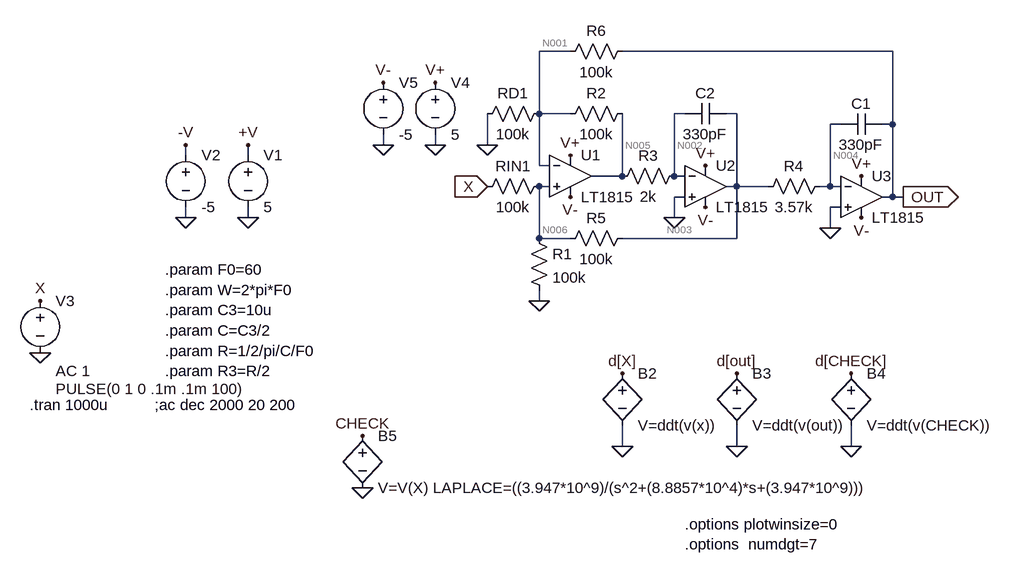
[diagram p0: schematic SR.asc]
* SR.asc
V1 +V 0 5
V2 -V 0 -5
V3 X 0 PULSE(0 1 0 .1m .1m 100) AC 1
B2 d[X] 0 V=ddt(v(x))
B3 d[out] 0 V=ddt(v(out))
B4 d[CHECK] 0 V=ddt(v(CHECK))
B5 CHECK 0 V=V(X) LAPLACE=((3.947*10^9)/(s^2+(8.8857*10^4)*s+(3.947*10^9)))
V4 V+ 0 5
V5 V- 0 -5
RIN1 N006 X 100k
R1 N006 0 100k
R2 N005 N001 100k
R3 N002 N005 2k
C1 OUT N004 330pF
R4 N004 N003 3.57k
C2 N003 N002 330pF
R5 N003 N006 100k
R6 OUT N001 100k
RD1 N001 0 100k
* U1: LT1815 (symbol Opamps\LT1815 not available, pins judged from their places): In+=N006 In-=N001 V+=V+ V-=V- OUT=N005
* U2: LT1815 (symbol Opamps\LT1815 not available, pins judged from their places): In+=0 In-=N002 V+=V+ V-=V- OUT=N003
* U3: LT1815 (symbol Opamps\LT1815 not available, pins judged from their places): In+=0 In-=N004 V+=V+ V-=V- OUT=OUT
.param F0=60
.param W=2*pi*F0
.param C3=10u
.param C=C3/2
.param R=1/2/pi/C/F0
.param R3=R/2
;ac dec 2000 20 200
.tran 1000u
.options plotwinsize=0
.options  numdgt=7
.backanno
.end

* Results of the author's LTspice run, read from the files saved beside the schematic
* Operating Point, zero values left out:
*   V(+v) = 5 V
*   V(-v) = -5 V
*   V(v+) = 5 V
*   V(v-) = -5 V
*   V(n006) = 80.08 mV
*   V(n005) = -4.994 mV
*   V(n001) = 80.08 mV
*   V(n002) = 5.222 µV
*   V(out) = -3.913 mV
*   V(n004) = 3.525 µV
*   V(n003) = -8.92 mV
*   I(Rd1) = 800.8 nA
*   I(R6) = -839.9 nA
*   I(R5) = -890 nA
*   I(R4) = 2.499 µA
*   I(R3) = 2.499 µA
*   I(R2) = -850.7 nA
*   I(R1) = 800.8 nA
*   I(Rin1) = 800.8 nA
*   I(V5) = 19.49 mA
*   I(V4) = -19.5 mA
*   I(V3) = 800.8 nA
*   Ix(u1:1) = -2.491 µA
*   Ix(u1:2) = -2.491 µA
*   Ix(u1:3) = 3.35 µA
*   Ix(u1:4) = 6.499 mA
*   Ix(u1:5) = -6.498 mA
*   Ix(u2:1) = -2.5 µA
*   Ix(u2:2) = -2.499 µA
*   Ix(u2:3) = 3.389 µA
*   Ix(u2:4) = 6.499 mA
*   Ix(u2:5) = -6.498 mA
*   Ix(u3:1) = -2.5 µA
*   Ix(u3:2) = -2.499 µA
*   Ix(u3:3) = 839.9 nA
*   Ix(u3:4) = 6.501 mA
*   Ix(u3:5) = -6.496 mA
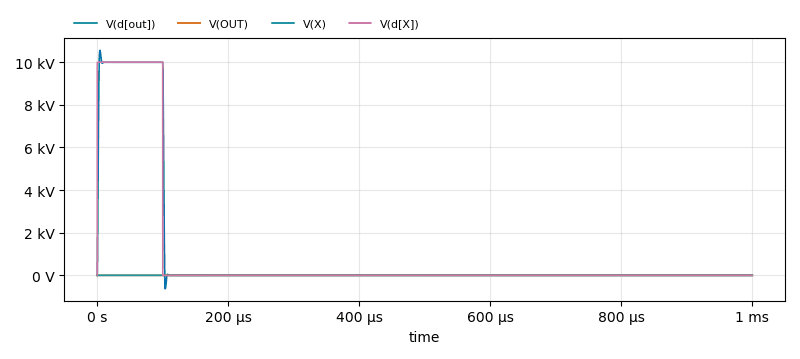
[diagram p1: Transient Analysis of SR.asc, plotted from the saved traces]
* Transient Analysis, 1 run:
*   V(d[out]): min -631.2 V, max 10.56 kV, average 1.001 kV, rms 3.153 kV, last 0 V
*   V(OUT): min -3.913 mV, max 996.9 mV, average 944.6 mV, rms 961.3 mV, last 995.7 mV
*   V(X): min 0 V, max 1 V, average 950 mV, rms 966.1 mV, last 1 V
*   V(d[X]): min 0 V, max 10 kV, average 1 kV, rms 3.163 kV, last 0 V